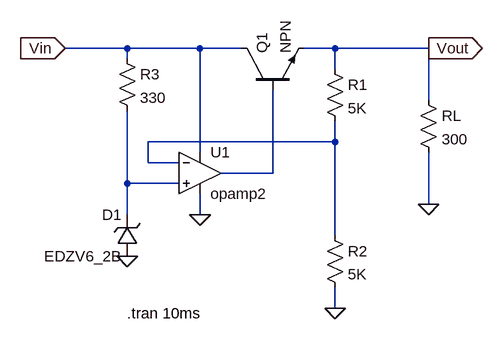
[diagram p0: schematic Draft1.asc]
Draft1.asc, the LTspice schematic file:
Version 4
SHEET 1 880 680
WIRE 80 176 -16 176
WIRE 192 176 80 176
WIRE 256 176 192 176
WIRE 400 176 352 176
WIRE 544 176 400 176
WIRE 80 192 80 176
WIRE 400 208 400 176
WIRE 544 256 544 176
WIRE 400 320 400 288
WIRE 400 320 112 320
WIRE 192 336 192 176
WIRE 112 352 112 320
WIRE 160 352 112 352
WIRE 304 368 304 240
WIRE 304 368 224 368
WIRE 80 384 80 272
WIRE 160 384 80 384
WIRE 544 416 544 336
WIRE 80 432 80 384
WIRE 192 432 192 400
WIRE 400 464 400 320
WIRE 400 576 400 544
FLAG 192 432 0
FLAG 400 576 0
FLAG 544 416 0
FLAG 80 496 0
FLAG -16 176 Vin
IOPIN -16 176 In
FLAG 544 176 Vout
IOPIN 544 176 Out
SYMBOL Res 64 176 R0
SYMATTR InstName R3
SYMATTR Value 330
SYMBOL Res 384 192 R0
SYMATTR InstName R1
SYMATTR Value 5K
SYMBOL Res 384 448 R0
SYMATTR InstName R2
SYMATTR Value 5K
SYMBOL Res 528 240 R0
SYMATTR InstName RL
SYMATTR Value 300
SYMBOL zener 96 496 R180
WINDOW 0 24 64 Left 2
WINDOW 3 24 0 Left 2
SYMATTR InstName D1
SYMATTR Value EDZV6_2B
SYMBOL npn 256 240 R270
SYMATTR InstName Q1
SYMBOL OpAmps/opamp2 192 304 R0
SYMATTR InstName U1
TEXT 80 584 Left 2 !.tran 10ms

The netlist it stands for:
* Draft1.asc
R3 Vin N003 330
R1 Vout N001 5K
R2 N001 0 5K
RL Vout 0 300
D1 0 N003 EDZV6_2B
Q1 Vin N002 Vout 0 NPN
XU1 N003 N001 Vin 0 N002 opamp2  ; pins In+ In- V+ V- OUT
.model D D
.lib standard.dio
.model NPN NPN
.model PNP PNP
.lib standard.bjt
.tran 10ms
.backanno
.end